# EAGLE schematic ROM Board (EAGLE 6.4)
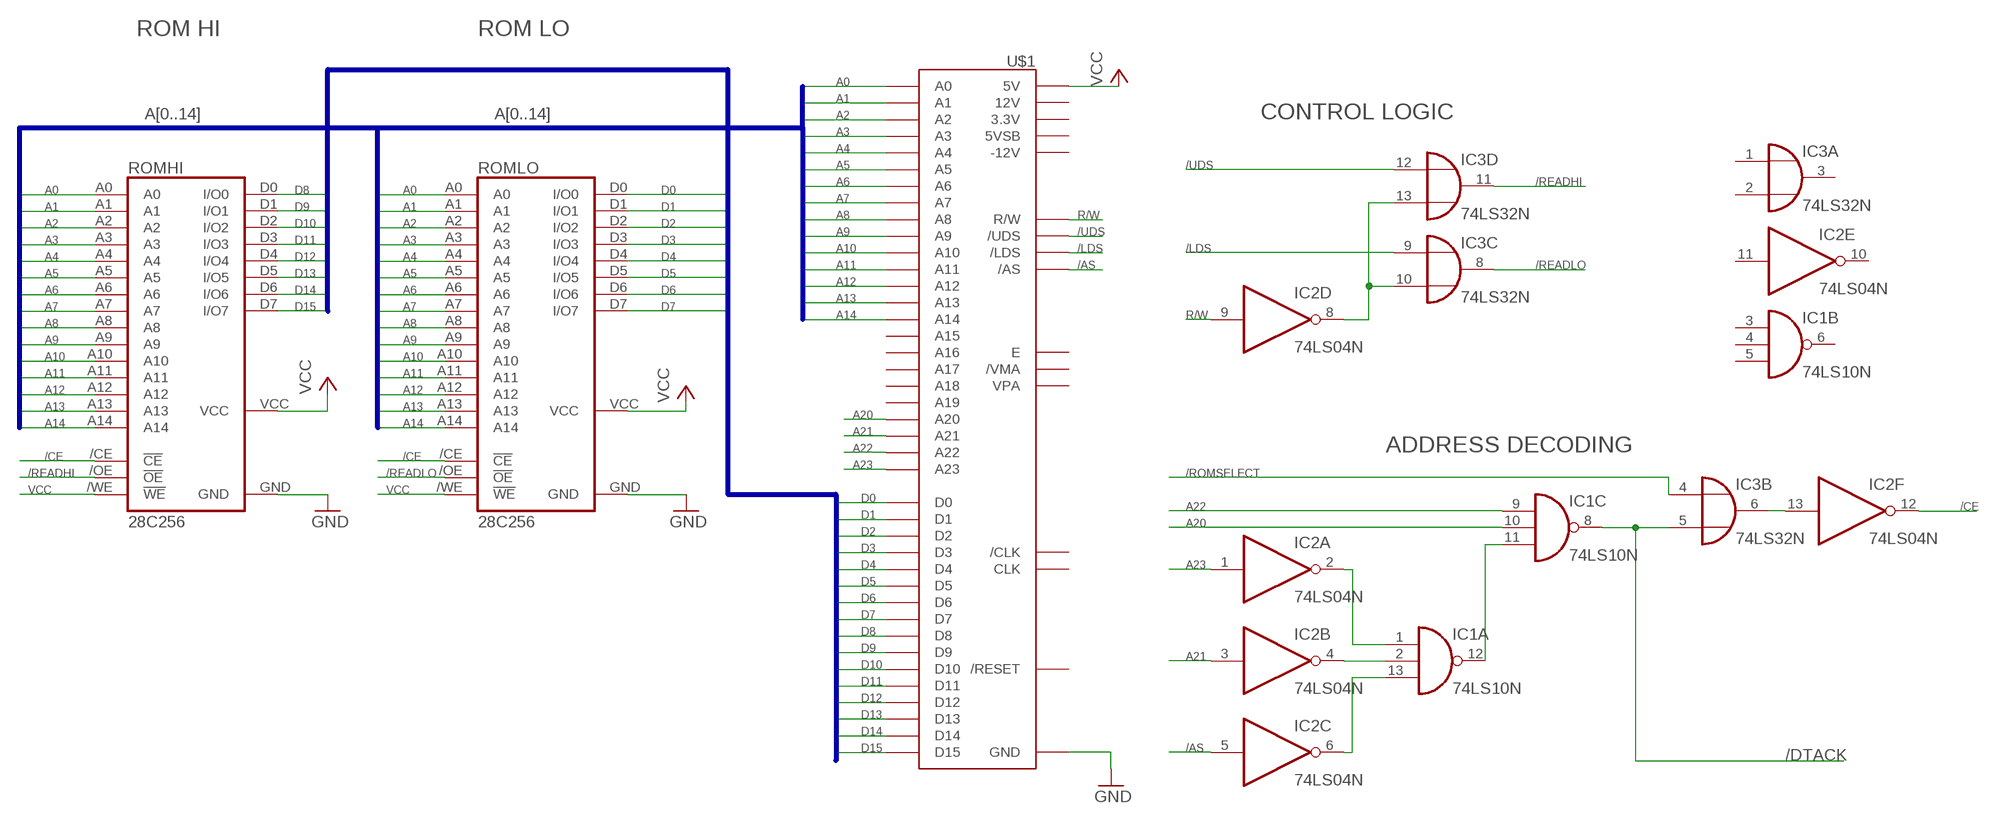
[diagram p0: schematic, sheet 1]

## Parts
IC1  74LS10N  [DIL14]
IC2  74LS04N  [DIL14]
IC3  74LS32N  [DIL14]
ROMHI  28C256  [DIL28-6]
ROMLO  28C256  [DIL28-6]
U$1  BLANKBOARD  [BLANKBOARD]

## Nets
/AS: IC2.5(C:I) U$1./AS
/CE: IC2.12(F:O) ROMHI./CE(!CE) ROMLO./CE(!CE)
/LDS: IC3.9(C:I0) U$1./LDS
/READHI: IC3.11(D:O) ROMHI./OE(!OE)
/READLO: IC3.8(C:O) ROMLO./OE(!OE)
/ROMSELECT: IC3.4(B:I0)
/UDS: IC3.12(D:I0) U$1./UDS
A0: ROMHI.A0 ROMLO.A0 U$1.A0
A1: ROMHI.A1 ROMLO.A1 U$1.A1
A2: ROMHI.A2 ROMLO.A2 U$1.A2
A3: ROMHI.A3 ROMLO.A3 U$1.A3
A4: ROMHI.A4 ROMLO.A4 U$1.A4
A5: ROMHI.A5 ROMLO.A5 U$1.A5
A6: ROMHI.A6 ROMLO.A6 U$1.A6
A7: ROMHI.A7 ROMLO.A7 U$1.A7
A8: ROMHI.A8 ROMLO.A8 U$1.A8
A9: ROMHI.A9 ROMLO.A9 U$1.A9
A10: ROMHI.A10 ROMLO.A10 U$1.A10
A11: ROMHI.A11 ROMLO.A11 U$1.A11
A12: ROMHI.A12 ROMLO.A12 U$1.A12
A13: ROMHI.A13 ROMLO.A13 U$1.A13
A14: ROMHI.A14 ROMLO.A14 U$1.A14
A20: IC1.10(C:I1) U$1.A20
A21: IC2.3(B:I) U$1.A21
A22: IC1.9(C:I0) U$1.A22
A23: IC2.1(A:I) U$1.A23
D0: ROMLO.D0(I/O0) U$1.D0
D1: ROMLO.D1(I/O1) U$1.D1
D2: ROMLO.D2(I/O2) U$1.D2
D3: ROMLO.D3(I/O3) U$1.D3
D4: ROMLO.D4(I/O4) U$1.D4
D5: ROMLO.D5(I/O5) U$1.D5
D6: ROMLO.D6(I/O6) U$1.D6
D7: ROMLO.D7(I/O7) U$1.D7
D8: ROMHI.D0(I/O0) U$1.D8
D9: ROMHI.D1(I/O1) U$1.D9
D10: ROMHI.D2(I/O2) U$1.D10
D11: ROMHI.D3(I/O3) U$1.D11
D12: ROMHI.D4(I/O4) U$1.D12
D13: ROMHI.D5(I/O5) U$1.D13
D14: ROMHI.D6(I/O6) U$1.D14
D15: ROMHI.D7(I/O7) U$1.D15
DECODEOUT: IC1.8(C:O) IC3.5(B:I1)
GND: ROMHI.GND ROMLO.GND U$1.GND
N$1: IC1.1(A:I0) IC2.2(A:O)
N$2: IC1.2(A:I1) IC2.4(B:O)
N$3: IC1.13(A:I2) IC2.6(C:O)
N$4: IC1.11(C:I2) IC1.12(A:O)
N$5: IC2.13(F:I) IC3.6(B:O)
N$6: IC2.8(D:O) IC3.10(C:I1) IC3.13(D:I1)
R/W: IC2.9(D:I) U$1.R/W
VCC: ROMHI./WE(!WE) ROMHI.VCC ROMLO./WE(!WE) ROMLO.VCC U$1.5V
Unconnected: IC1.3(B:I0) IC1.4(B:I1) IC1.5(B:I2) IC1.6(B:O) IC2.10(E:O) IC2.11(E:I) IC3.1(A:I0) IC3.2(A:I1) IC3.3(A:O) U$1.3V3(3.3V) U$1.5VSB U$1.12V U$1.-12V U$1./CLK U$1./RESET U$1./VMA U$1.A15 U$1.A16 U$1.A17 U$1.A18 U$1.A19 U$1.CLK U$1.E U$1.VPA

## Buses
A[0..14]
D[0..15]

## Notes on the sheet
- ROM HI | ROM LO
- CONTROL LOGIC
- ADDRESS DECODING
- /DTACK

## Power pins joined to a net without a drawn wire
GND: IC1.7(P:GND) IC2.7(P:GND) IC3.7(P:GND)
VCC: IC1.14(P:VCC) IC2.14(P:VCC) IC3.14(P:VCC)

## Library data of the parts
IC1 = 74xx-eu:74*10: Triple 3-input NAND gate
IC2 = 74xx-eu:74*04: Hex INVERTER
IC3 = 74xx-eu:74*32: Quad 2-input OR gate
ROMHI ROMLO = memory-nec:28C256: 28C256 32k x 8 parallel EEPROM
U$1 = Benchoff:BLANKBOARD